# Altium schematic sheet led5.SchDoc
size A4; DocumentNumber: 5; SheetNumber: 5; SheetTotal: 8
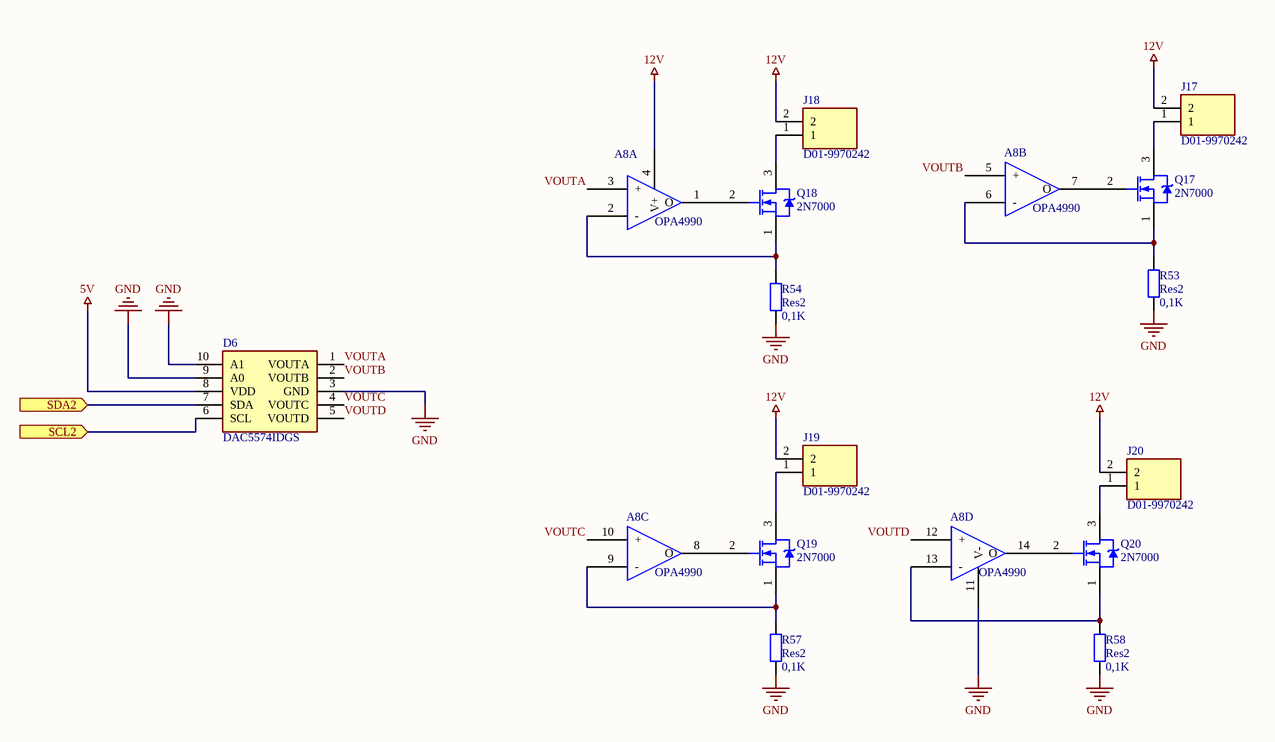
[diagram p0: led5.SchDoc]

## Parts
A8  OPA4990  [SOIC127P600X175-14N]  (parts A,B,C,D of 4)
D6  DAC5574IDGS  [SOP50P490X110-10N]
J17  D01-9970242  [HDR1X2]
J18  D01-9970242  [HDR1X2]
J19  D01-9970242  [HDR1X2]
J20  D01-9970242  [HDR1X2]
Q17  2N7000  [ONSC-TO-92-3-29-11]
Q18  2N7000  [ONSC-TO-92-3-29-11]
Q19  2N7000  [ONSC-TO-92-3-29-11]
Q20  2N7000  [ONSC-TO-92-3-29-11]
R53  Res2  value 0,1K  [C1210]
R54  Res2  value 0,1K  [C1210]
R57  Res2  value 0,1K  [C1210]
R58  Res2  value 0,1K  [C1210]

## Ports
SCL2 (in), SDA2 (in)

## Nets
5V: D6.8(VDD)
12V: A8.4(V+) J17.2 J18.2 J19.2 J20.2
GND: A8.11(V-) D6.3(GND) D6.9(A0) D6.10(A1) R53.1 R54.1 R57.1 R58.1
SCL2: D6.6(SCL) ; port SCL2
SDA2: D6.7(SDA) ; port SDA2
VOUTA: A8.3(+) D6.1(VOUTA)
VOUTB: A8.5(+) D6.2(VOUTB)
VOUTC: A8.10(+) D6.4(VOUTC)
VOUTD: A8.12(+) D6.5(VOUTD)
NetA8_1: A8.1(O) Q18.2(G)
NetA8_2: A8.2(-) Q18.1(S) R54.2
NetA8_6: A8.6(-) Q17.1(S) R53.2
NetA8_7: A8.7(O) Q17.2(G)
NetA8_8: A8.8(O) Q19.2(G)
NetA8_9: A8.9(-) Q19.1(S) R57.2
NetA8_13: A8.13(-) Q20.1(S) R58.2
NetA8_14: A8.14(O) Q20.2(G)
NetJ17_1: J17.1 Q17.3(D)
NetJ18_1: J18.1 Q18.3(D)
NetJ19_1: J19.1 Q19.3(D)
NetJ20_1: J20.1 Q20.3(D)

## Library data of the parts
D6 = DAC5574IDGS: Integrated Circuit; Manufacturer_Name: Texas Instruments; Datasheet Link: http://www.ti.com/lit/gpn/dac5574; Height: 1.1mm; Manufacturer_Part_Number: DAC5574IDGS; Mouser Part Number: 595-DAC5574IDGS; Mouser Price/Stock: https://www.mouser.com/Search/Refine.aspx?Keyword=595-DAC5574IDGS; RS Part Number: 6621533P; RS Price/Stock: http://uk.rs-online.com/web/p/products/6621533P
J17-J20 = D01-9970242: Connector; Manufacturer_Name: HARWIN; Datasheet Link: https://componentsearchengine.com/Datasheets/1/D01-9970242.pdf; Height: 4.25mm; Manufacturer_Part_Number: D01-9970242; Mouser Part Number: 855-D01-9970242; Mouser Price/Stock: https://www.mouser.com/Search/Refine.aspx?Keyword=855-D01-9970242
Q17-Q20 = CMP-1058-00936-1: Small Signal MOSFET, 200 mA, 60 V, N-Channel, 3-Pin TO-92, Bulk Box; Manufacturer: On Semiconductor; Ciss Typ (pF): 60; VGS(th) Max (V): 3; Crss Typ (pF): 5; Channel Polarity: N Channel; VGS Max (V): 20; Configuration: Single; PD Max (W): 0.35; Coss Typ (pF): 25; ID Max (A): 0.2; PackageVersion: Rev. AM; ComponentLink3URL: http://www.onsemi.cn/pub_link/Collateral/2N6426-D.PDF; ComponentLink2URL: http://www.onsemi.com/pub_link/Collateral/2N7000-D.PDF; DatasheetVersion: Rev. 8; Mounting Technology: Through Hole; V(BR)DSS Min (V): 60; PartNumber: 2N7000; PackageDescription: 3-Pin Transistor Outline, Body 4.825 x 3.685 mm, Pitch 1.27 mm; ComponentLink2Description: Datasheet; ComponentLink1URL: http://www.onsemi.com/; PackageReference: TO-92-3-29-11_AM_SL; Packing: Bulk Box; ComponentLink1Description: Manufacturer URL; Package Type: TO-92; ComponentLink3Description: Package Specification
R53 R54 R57 R58 = Res2: Resistor; Published: 8-Jun-2000; LatestRevisionDate: 17-Jul-2002; LatestRevisionNote: Re-released for DXP Platform.; PackageReference: AXIAL-0.4; Publisher: Altium Limited; PackageDescription: Axial Device, Thru-Hole; 2 Leads; 0.4 in Pin Spacing